# EAGLE design monoblink_wifi_v2 (EAGLE 9.0.1)
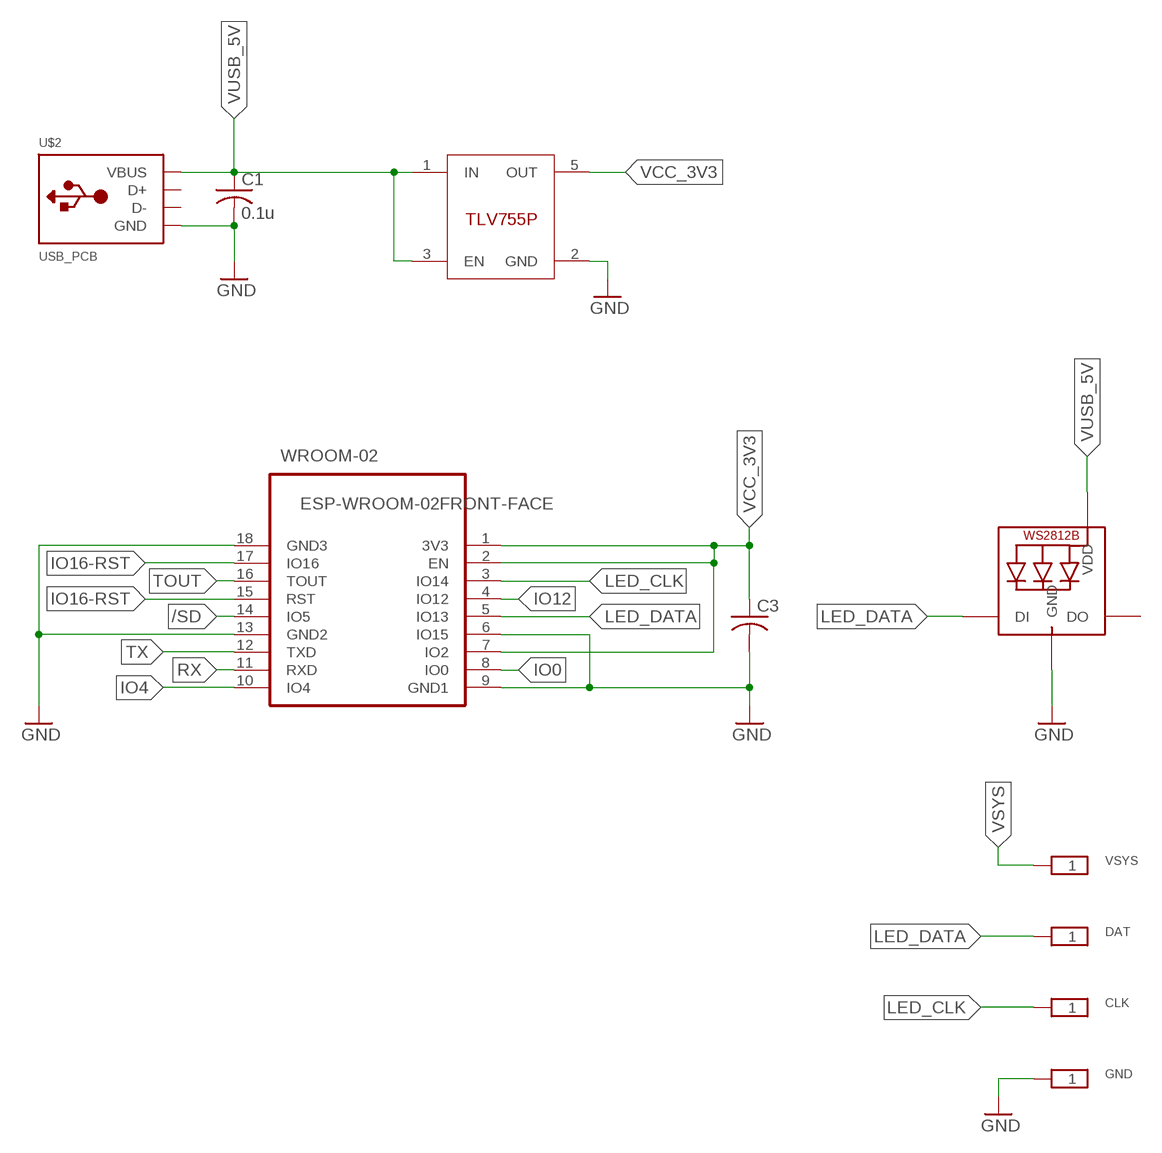
[diagram p0: schematic, sheet 1]

## Parts
C1  0.1u  C-USC0603  [C0603]
C3  C-USC0603  [C0603]
CLK  TESTPAD_PROG  [TP1.5MM]
DAT  TESTPAD_PROG  [TP1.5MM]
GND  TESTPAD_PROG  [TP1.5MM]
LDO  TLV755P  [SOT23-5]
LED  WS2812B5050  [WS2812B]
U$2  USB_PCB  [USB_PADS]
VSYS  TESTPAD_PROG  [TP1.5MM]
WROOM-02  ESP-WROOM-02FRONT-FACE  [FRONT-FACE]

## Nets
/SD: WROOM-02.14(IO5)
GND: C1.2 C3.2 GND.1 LDO.2(GND) LED.3-GND(GND) U$2.GND WROOM-02.6(IO15) WROOM-02.9(GND1) WROOM-02.13(GND2) WROOM-02.18(GND3)
IO0: WROOM-02.8(IO0)
IO4: WROOM-02.10(IO4)
IO12: WROOM-02.4(IO12)
IO16-RST: WROOM-02.15(RST) WROOM-02.17(IO16)
LED_CLK: CLK.1 WROOM-02.3(IO14)
LED_DATA: DAT.1 LED.4-DIN(DI) WROOM-02.5(IO13)
RX: WROOM-02.11(RXD)
TOUT: WROOM-02.16(TOUT)
TX: WROOM-02.12(TXD)
VCC_3V3: C3.1 LDO.5(OUT) WROOM-02.1(3V3) WROOM-02.2(EN) WROOM-02.7(IO2)
VSYS: VSYS.1
VUSB_5V: C1.1 LDO.1(IN) LDO.3(EN) LED.1-VDD(VDD) U$2.V_SUPPLY(VBUS)
Unconnected: LED.2-DOUT(DO) U$2.D+ U$2.D-

## Library data of the parts
C1 C3 = monoblink_wifi:C-US: CAPACITOR, American symbol; SPICEPREFIX: C
CLK DAT GND VSYS = monoblink_wifi:TESTPAD_PROG: TESTPAD
LDO = monoblink_wifi:TLV755P
LED = monoblink_wifi:WS2812B
U$2 = monoblink_wifi:USB_PCB
WROOM-02 = monoblink_wifi:ESP-WROOM-02: WiFi module - ESP-WROOM-02

## Board
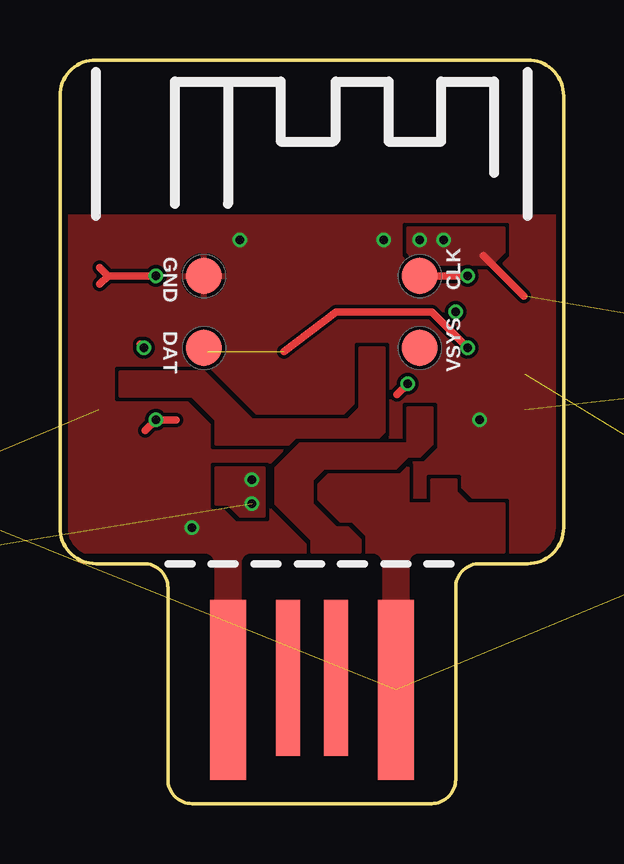
[diagram p1: board, top side]
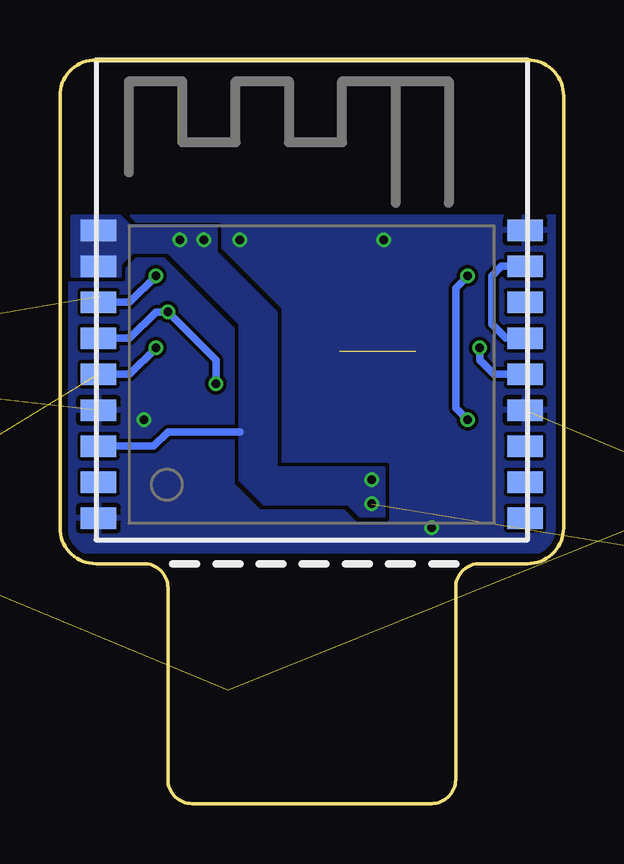
[diagram p2: board, bottom side, seen from below]

Size 21 x 31 mm. Coordinates in mm from the lower left corner, seen from the top.
Outline: 19.5,10 arc90 21,11.5 21,29.5 arc90 19.5,31 1.5,31 arc90 0,29.5 0,11.5 arc90 1.5,10 3.5,10 arc-90 4.5,9 4.5,1 arc90 5.5,0 15.5,0 arc90 16.5,1 16.5,9 arc-90 17.5,10 19.5,10
Copper layers (1*16): Top 0.018mm / dielectric 1.55mm / Bottom 0.018mm
Design rules "eC_2Layer_PClass6_BaseCopperO18_eCDefault": minimum track width 0.15mm, minimum drill 0.35mm, track to track 0.15mm, track to pad 0.15mm, pad to pad 0.15mm, via to via 0.15mm, smd to smd 0mil, copper to edge 0.25mm, drill to drill 0.35mm, minimum pad ring 0.175mm, minimum via ring 0.125mm, stop-mask expansion 0mil, vias tented up to drill 0.45mm, thermal gap 0.2mm

### Footprints (pad centres in the part's own frame; a part is rotated, then mirrored left to right if it is on the bottom)
C0603 = smd 1.1 x 1: 1 -0.85,0; 2 0.85,0
TP1.5MM = smd 1.5 x 1.5: 1 0,0
SOT23-5 = smd 0.55 x 1.2: 1 -0.95,-1.3; 2 0,-1.3; 3 0.95,-1.3; 4 0.95,1.3; 5 -0.95,1.3
WS2812B = smd 1.5 x 0.9: 1-VDD 2.45,-1.65; 2-DOUT 2.45,1.65; 3-GND -2.45,1.65; 4-DIN -2.45,-1.65
USB_PADS = smd 1 x 6.5: D+ 1,3.25; D- -1,3.25 | smd 1.5 x 7.5: GND 3.5,3.75; V_SUPPLY -3.5,3.75
FRONT-FACE = smd 1.485 x 0.9: 1 -8.893,4.9; 2 -8.893,3.4; 3 -8.893,1.9; 4 -8.893,0.4; 5 -8.893,-1.1; 6 -8.893,-2.6; 7 -8.893,-4.1; 8 -8.893,-5.6; 9 -8.893,-7.1; 10 8.893,-7.1; 11 8.893,-5.6; 12 8.893,-4.1; 13 8.893,-2.6; 14 8.893,-1.1; 15 8.893,0.4; 16 8.893,1.9; 17 8.893,3.4; 18 8.893,4.9

### Placement (x,y rotation side)
C1  27.5,10 0 top  (outside the outline)
C3  27,20 0 top  (outside the outline)
CLK  15,22 0 top
DAT  6,19 0 top
GND  6,22 0 top
LDO  -7,11.5 180 top  (outside the outline)
LED  28.5,15.5 0 top  (outside the outline)
U$2  10.5,8.5 180 top
VSYS  15,19 0 top
WROOM-02  10.5,19 0 bottom

### Tracks (layer width: path | path; a pad name or v marks a point on that pad's centre or on a via)
/SD  (via drill 0.35)
  Top 0.305: v3.5,19 3.35,19.15
  Bottom 0.305: 1.71,18 WROOM-02.14 2.9,17.9 3.5,18.5 v3.5,19
GND  (via drill 0.35)  (4 unrouted)
  other vias: 5.5,11.5 7.5,23.5 13.5,23.5 17.5,16
  pour Bottom (rank 2): -1,24.5 22,24.5 22,10.5 13,10.5 13,11.5 8,11.5 8,10.5 -1,10.5
  pour Top (rank 3): -1,24.5 22,24.5 22,10.5 16.5,10.5 16.5,12.5 4.5,12.5 4.5,10.5 -1,10.5
  pour Top (rank 3, no thermals): 4.5,10.5 4.5,12.5 16.5,12.5 16.5,10.5 8,10.5 arc90 7.5,10 7.5,8 6.5,8 6.5,10 arc90 6,10.5
  pour Bottom (no thermals): 13,10.5 13,11.5 8,11.5 8,10.5
IO12  (via drill 0.35)
  Top 0.305: v14.5,17.5 14.05,17.05
  Bottom 0.305: v14.5,17.5 14.5,18.5 v16.5,20.5 17,20.5 18.1,19.4 WROOM-02.4
IO16-RST
  Bottom 0.305: WROOM-02.17 2.6,22.4 3,22 3,20 2.4,19.4 WROOM-02.15
LDO_EN  (via drill 0.35)
  Top 0.305: 4.85,16 v4,16 3.55,15.55 | v4,22 2,22 | 2,22 1.65,22.35 | 2,22 1.65,21.65
  Bottom 0.305: v4,16 4.5,16.5 4.5,21.5 v4,22
LED_CLK  (via drill 0.35)
  Top 0.305: CLK.1 v17,22
  Bottom 0.305: WROOM-02.3 18.1,20.9 v17,22
LED_DATA  (via drill 0.35)  (2 unrouted)
  Top 0.305: 9.35,18.85 11.5,20.5 15.5,20.5 v17,19 | 6.15,18.85 DAT.1
  Bottom 0.305: v17,19 18.1,17.9 WROOM-02.5
VBAT
  pour Top (no thermals): 10.5,10.5 12.5,10.5 12.5,11 12,11.5 11.5,11.5 10.5,12.5 10.5,13.5 11,14 14,14 14.5,14.5 15,14.5 15.5,15 15.5,16.5 14.5,16.5 14.5,15 10,15 9,14 9,12.5 10.5,11
VCC_3V3  (via drill 0.35)  (2 unrouted)
  Top 0.305: 17.65,22.85 19.35,21.15
  Bottom 0.305: 13.5,15.5 16.5,15.5 17.1,14.9 WROOM-02.7 | 19.29,24 WROOM-02.1
  other vias: 8,12.5 8,13.5 16,23.5 15,23.5
  pour Bottom (no thermals): 12,14 7.5,14 7.5,12 8.5,12 9,12.5 12.5,12.5 13.5,13.5 13.5,20 16.5,23 18,23 18.5,22.5 18.5,22 20.5,22 20.5,24.5 18.5,24.5 18,24 14.5,24 14.5,23 12,20.5
  pour Top (no thermals): 14.5,24 14.5,23 15,22.5 18,22.5 18.5,23 18.5,24
  pour Top (no thermals): 8,14 8.5,14 8.5,12 7.5,12 7,12.5 6.5,12.5 6.5,14
VSYS
  Top 0.305: 14.85,18.85 VSYS.1
  pour Top (rank 2, no thermals): 12.5,19 12.5,16.5 12,16 8,16 6,18 2.5,18 2.5,17 5.5,17 6.5,16 6.5,15 13,15 13.5,15.5 13.5,19
VUSB_5V  (4 unrouted)
  pour Top (rank 2): 10,14.5 9.5,14 9.5,13 12,10.5 18.5,10.5 18.5,12.5 17,12.5 16.5,13 16.5,13.5 15.5,13.5 15.5,12.5 14.5,12.5 14.5,14 14,14.5
  pour Top (no thermals): 13,10.5 arc-90 13.5,10 13.5,8 14.5,8 14.5,10 arc-90 15,10.5